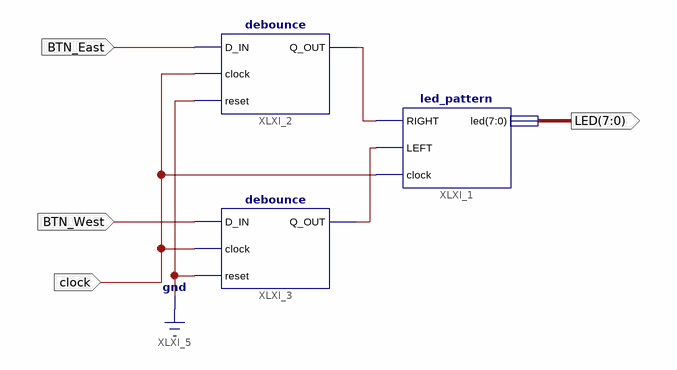
[diagram p0: schematic sheet 1]
// Xilinx ISE schematic Circuito.sch (spartan3e) as structural Verilog: 3 symbols, 4 ports
module Circuito (
  input  BTN_East,
  input  clock,
  input  BTN_West,
  output [7:0] LED
);

  wire XLXN_15, XLXN_16;

  led_pattern XLXI_1 (.RIGHT(XLXN_16), .LEFT(XLXN_15), .clock(clock), .led(LED));
  debounce XLXI_2 (.D_IN(BTN_East), .clock(clock), .reset(1'b0), .Q_OUT(XLXN_16));
  debounce XLXI_3 (.D_IN(BTN_West), .clock(clock), .reset(1'b0), .Q_OUT(XLXN_15));
endmodule
